# Altium schematic sheet Main-Schematic.SchDoc
size A; SheetNumber: 1; SheetTotal: 5
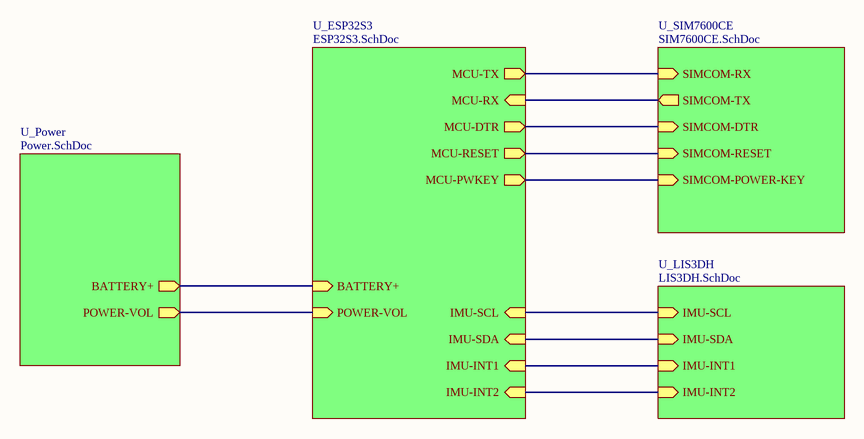
[diagram p0: Main-Schematic.SchDoc]

## Sub-sheets
U_ESP32S3 = ESP32S3.SchDoc: MCU-TX (out), MCU-RX (in), MCU-PWKEY (out), MCU-RESET (out), BATTERY+ (in), IMU-SCL (in), IMU-SDA (in), IMU-INT1 (in), IMU-INT2 (in), POWER-VOL (in), MCU-DTR (out)
U_LIS3DH = LIS3DH.SchDoc: IMU-SCL (in), IMU-SDA (in), IMU-INT1 (in), IMU-INT2 (in)
U_Power = Power.SchDoc: BATTERY+ (out), POWER-VOL (out)
U_SIM7600CE = SIM7600CE.SchDoc: SIMCOM-TX (out), SIMCOM-RX (in), SIMCOM-POWER-KEY (in), SIMCOM-RESET (in), SIMCOM-DTR (in)

## Nets
(unnamed): sheet U_Power/BATTERY+, sheet U_ESP32S3/BATTERY+
(unnamed): sheet U_Power/POWER-VOL, sheet U_ESP32S3/POWER-VOL
(unnamed): sheet U_ESP32S3/MCU-TX, sheet U_SIM7600CE/SIMCOM-RX
(unnamed): sheet U_ESP32S3/MCU-RX, sheet U_SIM7600CE/SIMCOM-TX
(unnamed): sheet U_ESP32S3/MCU-PWKEY, sheet U_SIM7600CE/SIMCOM-POWER-KEY
(unnamed): sheet U_ESP32S3/MCU-RESET, sheet U_SIM7600CE/SIMCOM-RESET
(unnamed): sheet U_ESP32S3/IMU-SCL, sheet U_LIS3DH/IMU-SCL
(unnamed): sheet U_ESP32S3/IMU-SDA, sheet U_LIS3DH/IMU-SDA
(unnamed): sheet U_ESP32S3/IMU-INT1, sheet U_LIS3DH/IMU-INT1
(unnamed): sheet U_ESP32S3/IMU-INT2, sheet U_LIS3DH/IMU-INT2
(unnamed): sheet U_ESP32S3/MCU-DTR, sheet U_SIM7600CE/SIMCOM-DTR